# EAGLE schematic Digital_Level_AccelBrkout_PDIP_AVR (EAGLE 7.4.0)
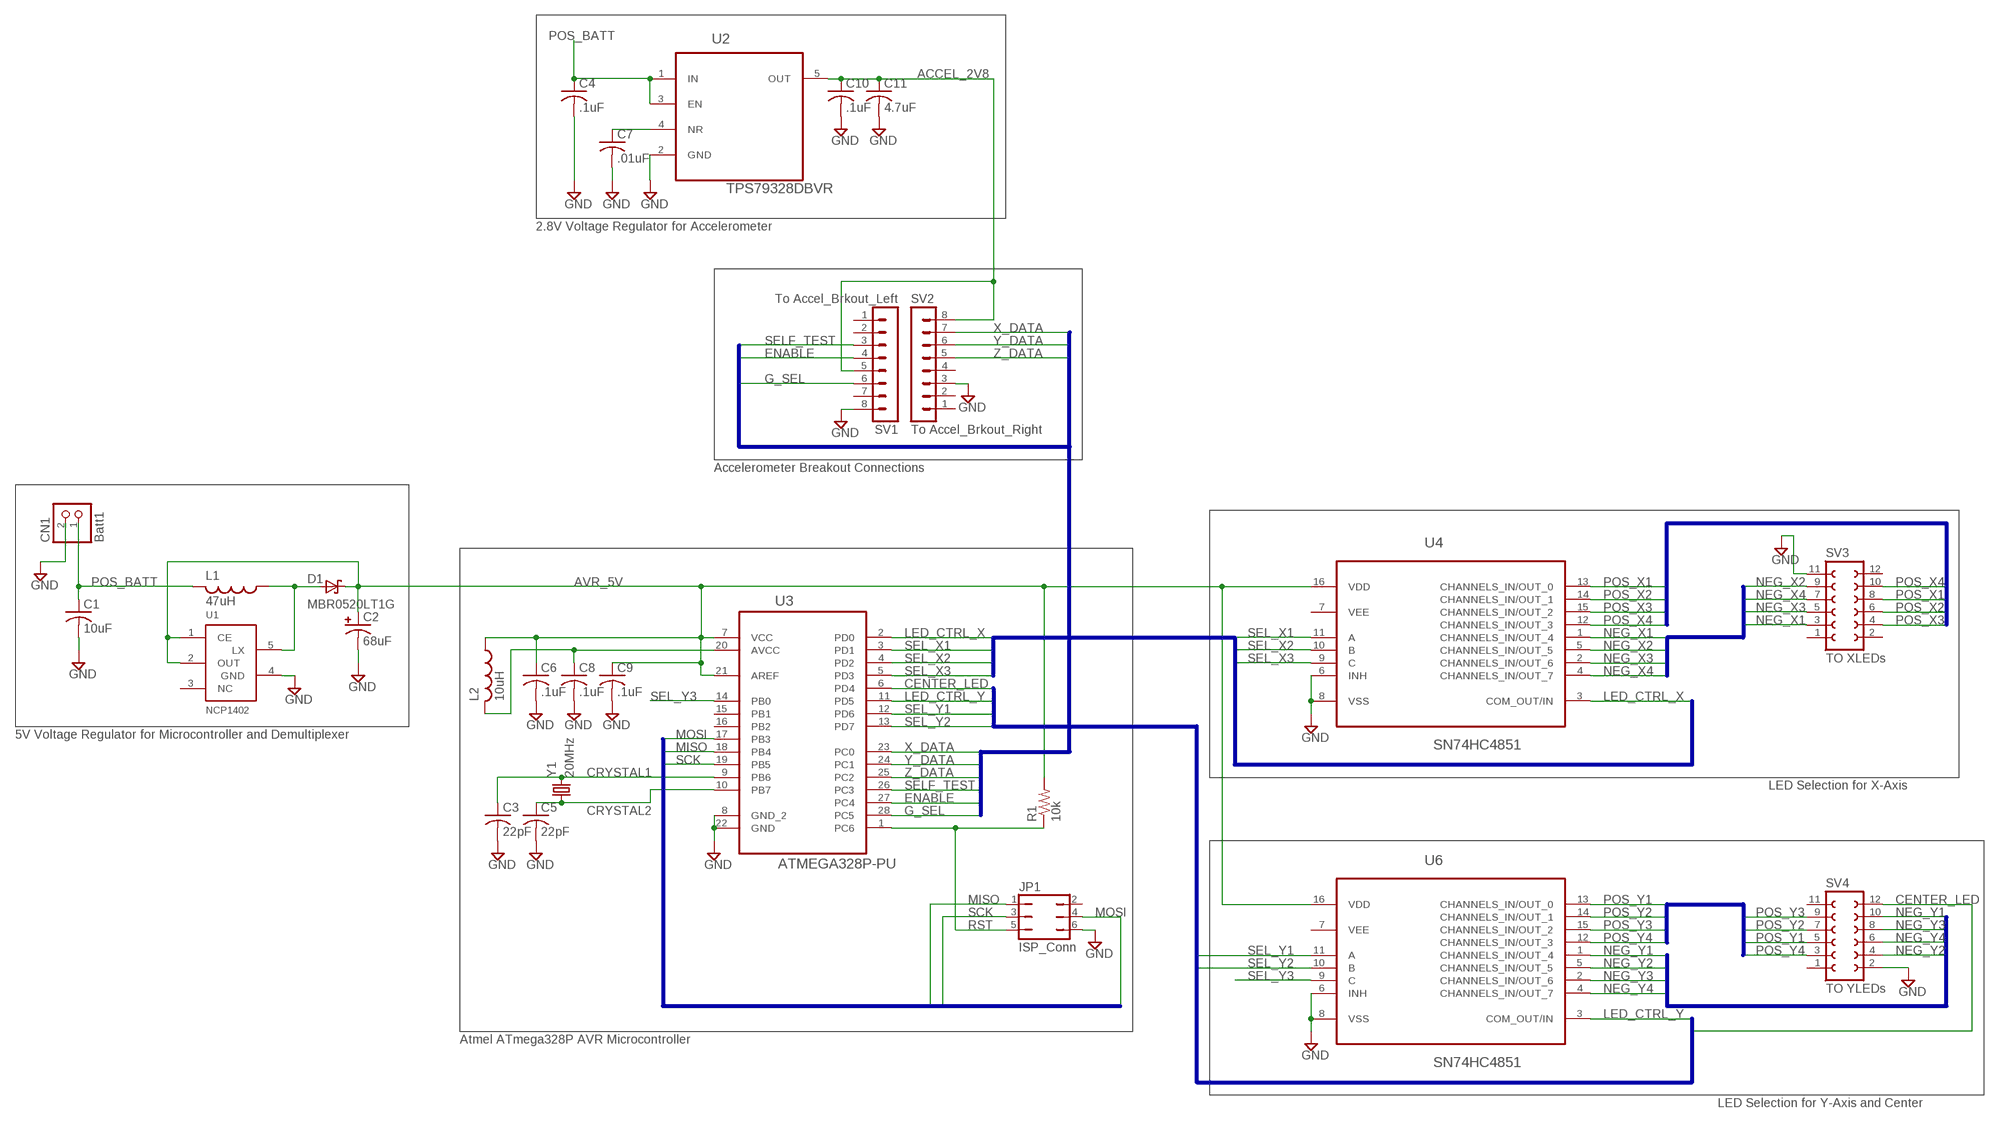
[diagram p0: schematic, sheet 1]

## Parts
C1  10uF  C-USC0805K  [C0805K]
C2  68uF  TANT_CAP  [2312_CAP]
C3  22pF  C-USC1210  [C1210]
C4  .1uF  C-USC0805  [C0805]
C5  22pF  C-USC1210  [C1210]
C6  .1uF  C-USC1210  [C1210]
C7  .01uF  CUSTOM_CAP  [0402_CAP]
C8  .1uF  C-USC1210  [C1210]
C9  .1uF  C-USC1210  [C1210]
C10  .1uF  C-USC0603K  [C0603K]
C11  4.7uF  C-USC0603  [C0603]
CN1  Batt1  JST_2PIN-SMT  [JST-PH-2-SMT]
D1  MBR0520LT1G  ONSEMI_SCHOTTKY  [MBR0520]
JP1  ISP_Conn  JP3Q  [JP3Q]
L1  47uH  BOURNS_INDUCTOR  [BOURNS_INDUCTOR]
L2  10uH  L-USL1812  [L1812]
R1  10k  R-US_R0805  [R0805]
SV1  To Accel_Brkout_Left  MA08-1  [MA08-1]
SV2  To Accel_Brkout_Right  MA08-1  [MA08-1]
SV3  TO XLEDs  FE06-2  [FE06-2]
SV4  TO YLEDs  FE06-2  [FE06-2]
U1  NCP1402  [WSON-8]
U2  TPS79328DBVR  [SOT95P280X145-5N]
U3  ATMEGA328P-PU  [DIP254P762X457-28]
U4  SN74HC4851  CD4051BE  [DIP254P762X508-16]
U6  SN74HC4851  CD4051BE  [DIP254P762X508-16]
Y1  20MHz  ABM3  [2-SMD]

## Nets
5V_REG1_LX: D1.P$2(A) L1.P$1 U1.5(LX)
ACCEL_2V8: C10.1 C11.1 SV1.5 SV2.8 U2.5(OUT)
AVCC_TO_VCC: C8.1 L2.2 U3.20(AVCC)
AVR_5V: C2.P C6.1 C9.1 D1.P$1(K) L2.1 R1.2 U1.1(CE) U1.2(OUT) U3.7(VCC) U3.21(AREF) U4.16(VDD) U6.16(VDD)
CENTER_LED: SV4.12 U3.6(PD4)
CRYSTAL1: C3.1 U3.9(PB6) Y1.P$2
CRYSTAL2: C5.1 U3.10(PB7) Y1.P$1
ENABLE: SV1.4 U3.27(PC4)
G_SEL: SV1.6 U3.28(PC5)
GND: C1.2 C2.N C3.2 C4.2 C5.2 C6.2 C7.2 C8.2 C9.2 C10.2 C11.2 CN1.2 JP1.6 SV1.8 SV2.3 SV3.11 SV4.2 U1.4(GND) U2.2(GND) U3.8(GND_2) U3.22(GND) U4.6(INH) U4.8(VSS) U6.6(INH) U6.8(VSS)
LED_CTRL_X: U3.2(PD0) U4.3(COM_OUT/IN)
LED_CTRL_Y: U3.11(PD5) U6.3(COM_OUT/IN)
LIN-REG_NR-PIN: C7.1 U2.4(NR)
MISO: JP1.1 U3.18(PB4)
MOSI: JP1.4 U3.17(PB3)
NEG_X1: SV3.3 U4.1(CHANNELS_IN/OUT_4)
NEG_X2: SV3.9 U4.5(CHANNELS_IN/OUT_5)
NEG_X3: SV3.5 U4.2(CHANNELS_IN/OUT_6)
NEG_X4: SV3.7 U4.4(CHANNELS_IN/OUT_7)
NEG_Y1: SV4.10 U6.1(CHANNELS_IN/OUT_4)
NEG_Y2: SV4.4 U6.5(CHANNELS_IN/OUT_5)
NEG_Y3: SV4.8 U6.2(CHANNELS_IN/OUT_6)
NEG_Y4: SV4.6 U6.4(CHANNELS_IN/OUT_7)
POS_BATT: C1.1 C4.1 CN1.1 L1.P$2 U2.1(IN) U2.3(EN)
POS_X1: SV3.8 U4.13(CHANNELS_IN/OUT_0)
POS_X2: SV3.6 U4.14(CHANNELS_IN/OUT_1)
POS_X3: SV3.4 U4.15(CHANNELS_IN/OUT_2)
POS_X4: SV3.10 U4.12(CHANNELS_IN/OUT_3)
POS_Y1: SV4.5 U6.13(CHANNELS_IN/OUT_0)
POS_Y2: SV4.7 U6.14(CHANNELS_IN/OUT_1)
POS_Y3: SV4.9 U6.15(CHANNELS_IN/OUT_2)
POS_Y4: SV4.3 U6.12(CHANNELS_IN/OUT_3)
RST: JP1.5 R1.1 U3.1(PC6)
SCK: JP1.3 U3.19(PB5)
SEL_X1: U3.3(PD1) U4.11(A)
SEL_X2: U3.4(PD2) U4.10(B)
SEL_X3: U3.5(PD3) U4.9(C)
SEL_Y1: U3.12(PD6) U6.11(A)
SEL_Y2: U3.13(PD7) U6.10(B)
SEL_Y3: U3.14(PB0) U6.9(C)
SELF_TEST: SV1.3 U3.26(PC3)
X_DATA: SV2.7 U3.23(PC0)
Y_DATA: SV2.6 U3.24(PC1)
Z_DATA: SV2.5 U3.25(PC2)
Unconnected: JP1.2 SV1.1 SV1.2 SV1.7 SV2.1 SV2.2 SV2.4 SV3.1 SV3.2 SV3.12 SV4.1 SV4.11 U1.3(NC) U3.15(PB1) U3.16(PB2) U4.7(VEE) U6.7(VEE)

## Buses
SELF_TEST,ENABLE,G_SEL,X_DATA,Y_DATA,Z_DATA
MISO,MOSI,SCK
POS_X1,POS_X2,POS_X3,POS_X4
NEG_X1,NEG_X2,NEG_X3,NEG_X4
POS_Y1,POS_Y2,POS_Y3,POS_Y4
NEG_Y1,NEG_Y2,NEG_Y3,NEG_Y4
LED_CTRL_X,SEL_X1,SEL_X2,SEL_X3
CENTER_LED,LED_CTRL_Y,SEL_Y1,SEL_Y2

## Notes on the sheet
- 2.8V Voltage Regulator for Accelerometer
- Accelerometer Breakout Connections
- 5V Voltage Regulator for Microcontroller and Demultiplexer
- LED Selection for X-Axis
- Atmel ATmega328P AVR Microcontroller
- LED Selection for Y-Axis and Center

## Library data of the parts
C1 C4 C6 C8-C11 = rcl:C-US: CAPACITOR, American symbol
C2 = cal_zabel:TANT_CAP
C3 C5 = resistor:C-US: CAPACITOR, American symbol
C7 = cal_zabel:CUSTOM_CAP
CN1 = adafruit:JST_2PIN: JST 2-Pin Connectors of various flavors SMT-RA (S2B-PH-SM4) 4UConnector #17311 SMT (B2B-PH-SM4) THM-RA (S2B-PH) THM (B2B-PH)
D1 = cal_zabel:ONSEMI_SCHOTTKY
JP1 = jumper:JP3Q: JUMPER
L1 = cal_zabel:BOURNS_INDUCTOR
L2 = rcl:L-US: INDUCTOR, American symbol
R1 = rcl:R-US_: RESISTOR, American symbol
SV1 SV2 = con-lstb:MA08-1: PIN HEADER; OC_FARNELL: unknown; OC_NEWARK: unknown
SV3 SV4 = con-lsta:FE06-2: FEMALE HEADER; OC_FARNELL: unknown; OC_NEWARK: unknown
U1 = cal_zabel:NCP1402
U2 = Texas Instruments_By_element14_Batch_1:TPS79328DBVR: ULTRALOW-NOISE, HIGH PSRR, FAST RF 200mA LOW-DROPOUT LINEAR REGULATORS IN NanoStar? WAFER CHIP SCALE AND SOT23; MPN: TPS79328DBVR; OC_FARNELL: -; OC_NEWARK: 77C1361; PACKAGE: SOT-23-5; SUPPLIER: Texas Instruments
U3 = Atmel_By_element14_Batch_1-00:ATMEGA328P-PU: 8-bit Microcontroller with In-System Programmable Flash; MPN: ATMEGA328P-PU; OC_FARNELL: 1715487; OC_NEWARK: 15R0268; PACKAGE: PDIP-28; SUPPLIER: Atmel
U4 U6 = Texas Instruments_By_element14_Batch_1:CD4051BE: The CD4051B is a single 8-Channel multiplexer having three binary control inputs.; MPN: CD4051BE; OC_FARNELL: 1106109; OC_NEWARK: 60K5119; PACKAGE: PDIP-16; SUPPLIER: Texas Instruments
Y1 = cal_zabel:ABM3